# Altium schematic sheet Power.SchDoc
size 127 x 165 mm; SheetNumber: 1; SheetTotal: 1
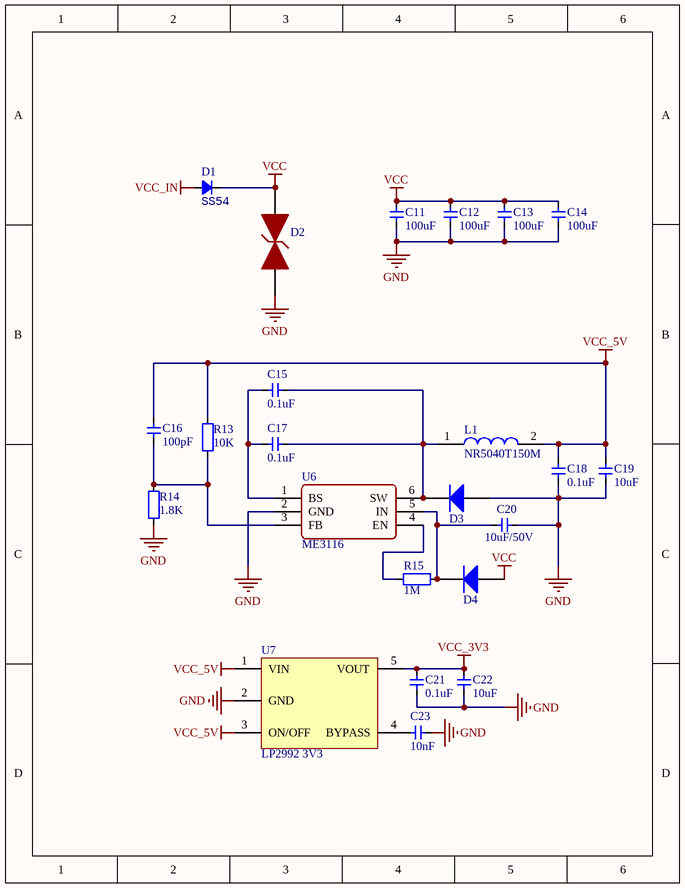
[diagram p0: Power.SchDoc]

## Parts
C11  100uF  [1206-CAP]
C12  100uF  [1206-CAP]
C13  100uF  [1206-CAP]
C14  100uF  [1206-CAP]
C15  0.1uF  [CAP_0402]
C16  100pF  [CAP_0402]
C17  0.1uF  [CAP_0402]
C18  0.1uF  [CAP_0402]
C19  10uF  [CAP_0402]
C20  10uF/50V  [CAP_0402]
C21  0.1uF  [CAP_0402]
C22  10uF  [CAP_0402]
C23  10nF  [CAP_0402]
D1  SS54  [DO-214AC]
D2  SMBJ28CA  [SMBJ-CA_MFG]  (value not drawn)
D3  二极管-5819W  [SOD-323]  (value not drawn)
D4  二极管-5819W  [SOD-323]  (value not drawn)
L1  NR5040T150M  [NR5040T150M]
R13  10K  [RES_0402]
R14  1.8K  [RES_0402]
R15  1M  [RES_0402]
U6  ME3116  [SOT23-6]
U7  LP2992 3V3  [SOT23-5]

## Nets
GND: C11.1 C12.1 C13.1 C14.1 C18.1 C19.1 C20.1 C21.1 C22.1 C23.1 D2.1 D3.1(A) R14.1 U6.2(GND) U7.2(GND)
VCC: C11.2 C12.2 C13.2 C14.2 D1.2(K) D2.2 D4.1(A)
VCC_3V3: C21.2 C22.2 U7.5(VOUT)
VCC_5V: C16.1 C18.2 C19.2 L1.2 R13.2 U7.1(VIN) U7.3(ON/OFF)
VCC_IN: D1.1(A)
NetC15_1: C15.1 C17.1 D3.2(K) L1.1 U6.6(SW)
NetC15_2: C15.2 C17.2 U6.1(BS)
NetC16_2: C16.2 R13.1 R14.2 U6.3(FB)
NetC20_2: C20.2 D4.2(K) R15.1 U6.5(IN)
NetC23_2: C23.2 U7.4(BYPASS)
NetR15_2: R15.2 U6.4(EN)

## Library data of the parts
C11-C14 = 电容-1206: Capacitor; Value: 0.1u
C15-C23 = 电容-0402: Capacitor; Value: 0.1u
D1 = Diode_SMA: Diode; Type: SMA; Value: SS54
D3 D4 = 二极管-5819W: 40V
L1 = NR5040T150M: Inductor; Manufacturer_Name: TAIYO YUDEN; Datasheet Link: https://www.arrow.com/en/products/nr5040t150m/taiyo-yuden; Height: 4mm; Manufacturer_Part_Number: NR5040T150M; Mouser Part Number: 963-NR5040T150M; Mouser Price/Stock: https://www.mouser.co.uk/ProductDetail/TAIYO-YUDEN/NR5040T150M?qs=PzICbMaShUfy55J2e2ZihQ%3D%3D; Arrow Part Number: NR5040T150M; Arrow Price/Stock: https://www.arrow.com/en/products/nr5040t150m/taiyo-yuden
R13-R15 = 电阻-0402: Resistor; Value: 22R
U6 = ME3116: DC-DC
U7 = LP2992: LDO